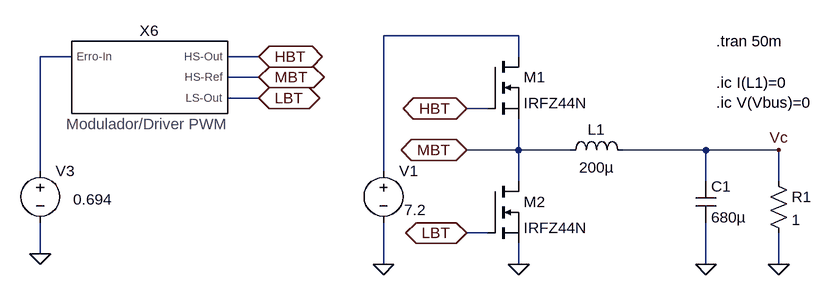
[diagram p0: schematic Conversor_buck.asc]
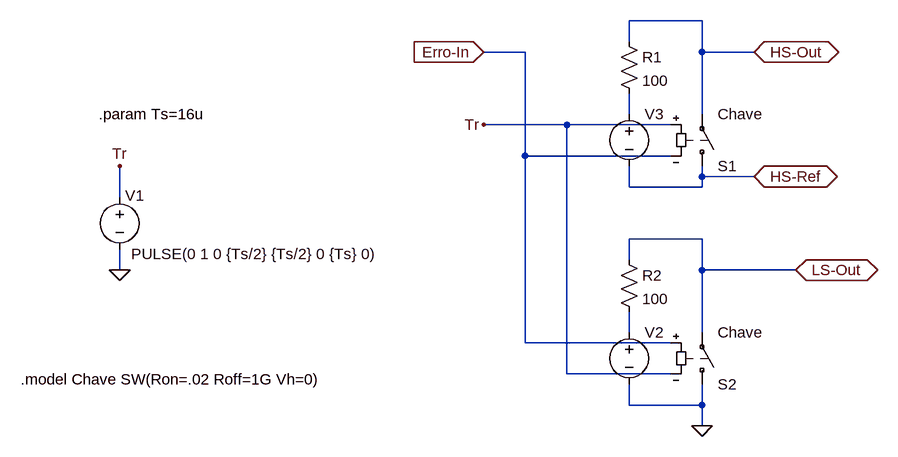
[diagram p1: sub-circuit modulador_pwm_driver.asc]
Conversor_buck.asc, the LTspice schematic file:
Version 4
SHEET 1 2244 924
WIRE 0 -208 -208 -208
WIRE -688 -176 -736 -176
WIRE -400 -176 -448 -176
WIRE 0 -176 0 -208
WIRE -400 -144 -448 -144
WIRE -400 -112 -448 -112
WIRE -48 -96 -80 -96
WIRE 0 -32 0 -80
WIRE 0 -32 -80 -32
WIRE 80 -32 0 -32
WIRE 288 -32 160 -32
WIRE 400 -32 288 -32
WIRE -736 0 -736 -176
WIRE -208 0 -208 -208
WIRE 0 16 0 -32
WIRE 288 16 288 -32
WIRE 400 16 400 -32
WIRE -48 96 -80 96
WIRE -736 128 -736 80
WIRE -208 144 -208 80
WIRE 0 144 0 112
WIRE 288 144 288 80
WIRE 400 144 400 96
FLAG -208 144 0
FLAG -80 -96 HBT
IOPIN -80 -96 BiDir
FLAG 0 144 0
FLAG -80 -32 MBT
IOPIN -80 -32 BiDir
FLAG -400 -176 HBT
IOPIN -400 -176 BiDir
FLAG -400 -112 LBT
IOPIN -400 -112 BiDir
FLAG -80 96 LBT
IOPIN -80 96 BiDir
FLAG -400 -144 MBT
IOPIN -400 -144 BiDir
FLAG 288 144 0
FLAG 400 144 0
FLAG 400 -32 Vc
FLAG -736 128 0
SYMBOL voltage -208 -16 R0
WINDOW 3 32 76 Left 2
WINDOW 123 0 0 Left 2
WINDOW 39 0 0 Left 0
SYMATTR Value 7.2
SYMATTR InstName V1
SYMBOL ind 64 -16 R270
WINDOW 0 32 56 VTop 2
WINDOW 3 5 56 VBottom 2
SYMATTR InstName L1
SYMATTR Value 200µ
SYMATTR SpiceLine Ipk=6 Rser=20m
SYMBOL cap 272 16 R0
SYMATTR InstName C1
SYMATTR Value 680µ
SYMATTR SpiceLine V=100 Rser=0 Lser=500p Rpar=12Meg
SYMBOL modulador_PWM_driver -576 -144 R0
SYMATTR InstName X6
SYMBOL res 384 0 R0
SYMATTR InstName R1
SYMATTR Value 1
SYMBOL voltage -736 -16 R0
WINDOW 123 0 0 Left 0
WINDOW 39 24 124 Left 2
WINDOW 3 51 60 Left 2
SYMATTR Value 0.694
SYMATTR InstName V3
SYMBOL nmos -48 -176 R0
SYMATTR InstName M1
SYMATTR Value IRFZ44N
SYMBOL nmos -48 16 R0
SYMATTR InstName M2
SYMATTR Value IRFZ44N
TEXT 304 -200 Left 2 !.tran 50m
TEXT 304 -136 Left 2 !.ic I(L1)=0\n.ic V(Vbus)=0

modulador_pwm_driver.asc, the sub-circuit schematic file:
Version 4
SHEET 1 1388 680
WIRE 1104 -16 992 -16
WIRE 992 16 992 -16
WIRE 832 32 768 32
WIRE 1104 32 1104 -16
WIRE 1184 32 1104 32
WIRE 992 128 992 96
WIRE 1104 128 1104 32
WIRE 896 144 768 144
WIRE 1056 144 896 144
WIRE 832 192 832 32
WIRE 1056 192 832 192
WIRE 1104 224 1104 208
WIRE 1184 224 1104 224
WIRE 992 240 992 208
WIRE 1104 240 1104 224
WIRE 1104 240 992 240
WIRE 208 256 208 208
WIRE 1104 320 992 320
WIRE 992 352 992 320
WIRE 208 368 208 336
WIRE 1104 368 1104 320
WIRE 1248 368 1104 368
WIRE 992 464 992 432
WIRE 1104 464 1104 368
WIRE 832 480 832 192
WIRE 1056 480 832 480
WIRE 896 528 896 144
WIRE 1056 528 896 528
WIRE 992 576 992 544
WIRE 1104 576 1104 544
WIRE 1104 576 992 576
WIRE 1104 608 1104 576
FLAG 1184 32 HS-Out
IOPIN 1184 32 BiDir
FLAG 1248 368 LS-Out
IOPIN 1248 368 BiDir
FLAG 1184 224 HS-Ref
IOPIN 1184 224 BiDir
FLAG 768 32 Erro-In
IOPIN 768 32 In
FLAG 208 368 0
FLAG 208 208 Tr
FLAG 1104 608 0
FLAG 768 144 Tr
SYMBOL voltage 208 240 R0
WINDOW 3 18 103 Left 2
WINDOW 123 0 0 Left 2
WINDOW 0 9 13 Left 2
SYMATTR Value PULSE(0 1 0 {Ts/2} {Ts/2} 0 {Ts} 0)
SYMATTR InstName V1
SYMATTR SpiceLine Rser=0
SYMBOL sw 1104 560 M180
SYMATTR InstName S2
SYMATTR Value Chave
SYMBOL res 976 336 R0
SYMATTR InstName R2
SYMATTR Value 100
SYMBOL voltage 992 448 R0
WINDOW 3 24 96 Invisible 2
WINDOW 123 0 0 Left 2
SYMATTR Value 16
SYMATTR SpiceLine Rser=0
SYMATTR InstName V2
SYMBOL sw 1104 224 M180
SYMATTR InstName S1
SYMATTR Value Chave
SYMBOL res 976 0 R0
SYMATTR InstName R1
SYMATTR Value 100
SYMBOL voltage 992 112 R0
WINDOW 3 24 96 Invisible 2
WINDOW 123 0 0 Left 2
SYMATTR Value 16
SYMATTR SpiceLine Rser=0
SYMATTR InstName V3
TEXT 176 128 Left 2 !.param Ts=16u
TEXT 56 536 Left 2 !.model Chave SW(Ron=.02 Roff=1G Vh=0)

The netlist it stands for:
* Conversor_buck.asc
V1 N001 0 7.2
L1 MBT Vc 200µ Ipk=6 Rser=20m
C1 Vc 0 680µ V=100 Rser=0 Lser=500p Rpar=12Meg
XX6 N002 HBT MBT LBT modulador_pwm_driver
R1 Vc 0 1
V3 N002 0 0.694
M1 N001 HBT MBT MBT IRFZ44N
M2 MBT LBT 0 0 IRFZ44N

* block symbol definitions
.subckt modulador_pwm_driver Erro-In HS-Out HS-Ref LS-Out
V1 Tr 0 PULSE(0 1 0 {Ts/2} {Ts/2} 0 {Ts} 0) Rser=0
S2 0 LS-Out Erro-In Tr Chave
R2 LS-Out N002 100
V2 N002 0 16 Rser=0
S1 HS-Ref HS-Out Tr Erro-In Chave
R1 HS-Out N001 100
V3 N001 HS-Ref 16 Rser=0
.param Ts=16u
.model Chave SW(Ron=.02 Roff=1G Vh=0)
.ends modulador_pwm_driver

.model NMOS NMOS
.model PMOS PMOS
.lib standard.mos
.tran 50m
.ic I(L1)=0
.ic V(Vbus)=0
.backanno
.end